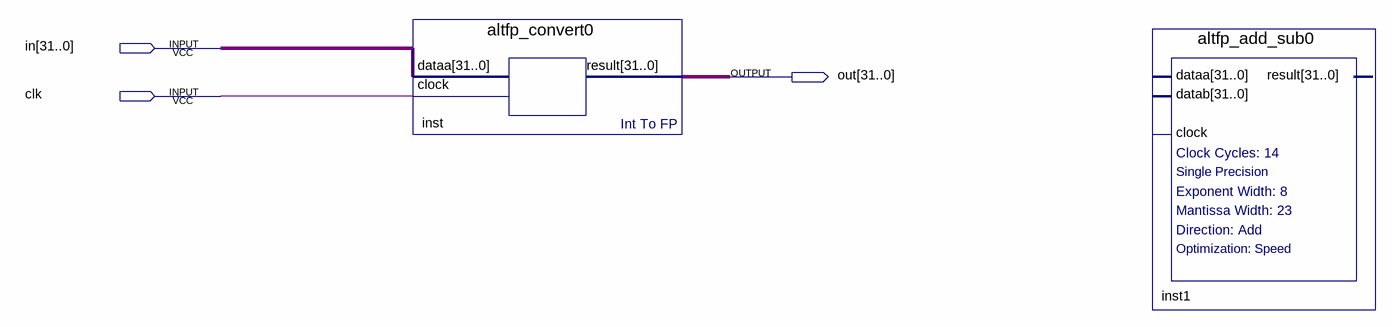
[diagram p0: schematic sheet]
// Quartus schematic Block1.bdf as structural Verilog: 2 symbols, 3 pins
module Block1 (
  input  [31:0] in,
  input  clk,
  output [31:0] out
);

  altfp_convert0 inst (.dataa(in), .clock(clk), .result(out));
  altfp_add_sub0 inst1 ();  // open: dataa, datab, clock, result
endmodule
